# Altium schematic sheet Power Input and Regulators.SchDoc
size A; DocumentNumber: 11; SheetNumber: 11; SheetTotal: 11
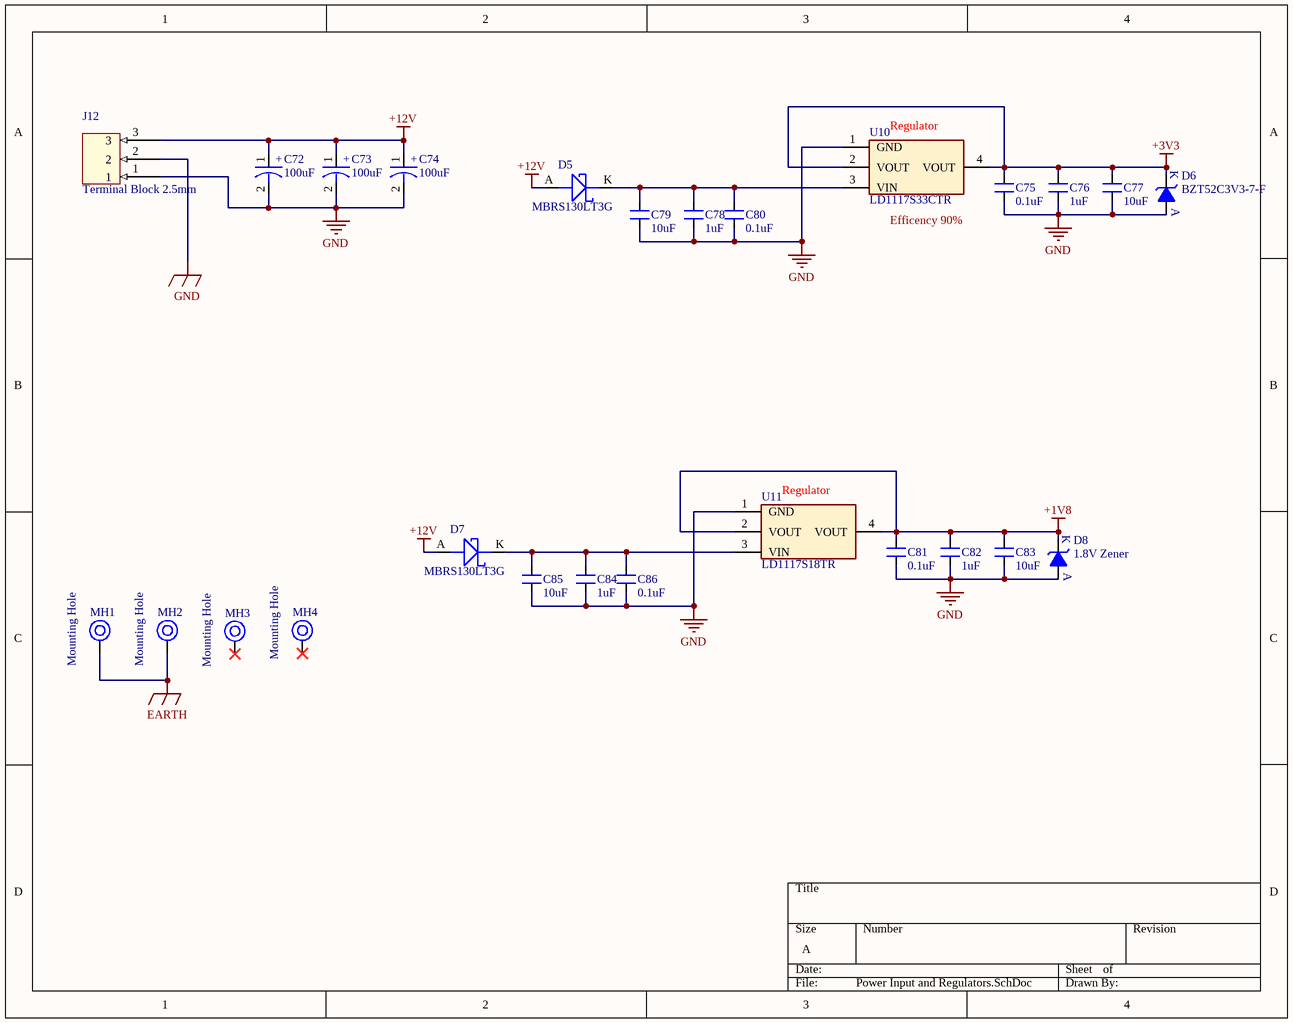
[diagram p0: Power Input and Regulators.SchDoc]

## Parts
C72  100uF  [ACAP_P305_D393_H393_RAD]
C73  100uF  [ACAP_P305_D393_H393_RAD]
C74  100uF  [ACAP_P305_D393_H393_RAD]
C75  0.1uF  [CAP_0805]
C76  1uF  [CAP_0805]
C77  10uF  [CAP_1206]
C78  1uF  [CAP_0805]
C79  10uF  [CAP_1206]
C80  0.1uF  [CAP_0805]
C81  0.1uF  [CAP_0805]
C82  1uF  [CAP_0805]
C83  10uF  [CAP_1206]
C84  1uF  [CAP_0805]
C85  10uF  [CAP_1206]
C86  0.1uF  [CAP_0805]
D5  MBRS130LT3G  [DIO_SMB_DO-214AA]
D6  BZT52C3V3-7-F  [DIO_SOD-123]
D7  MBRS130LT3G  [DIO_SMB_DO-214AA]
D8  1.8V Zener  [DIO_DO-213AB_SMD]
J12  Terminal Block 2.5mm  [CON3_100_TB_TH_ST]
MH1  Mounting Hole  [MOUNTING]
MH2  Mounting Hole  [MOUNTING]
MH3  Mounting Hole  [MOUNTING]
MH4  Mounting Hole  [MOUNTING]
U10  LD1117S33CTR  [SOT223_3]
U11  LD1117S18TR  [SOT223_3]

## Nets
+1V8: C81.2 C82.2 C83.2 D8.K U11.2(VOUT) U11.4(VOUT)
+3V3: C75.2 C76.2 C77.2 D6.K U10.2(VOUT) U10.4(VOUT)
+12V: C72.1 C73.1 C74.1 D5.A D7.A J12.3
EARTH: MH1.1 MH2.1
GND: C72.2 C73.2 C74.2 C75.1 C76.1 C77.1 C78.2 C79.1 C80.1 C81.1 C82.1 C83.1 C84.2 C85.1 C86.1 D6.A D8.A J12.1 J12.2 U10.1(GND) U11.1(GND)
NetC78_1: C78.1 C79.2 C80.2 D5.K U10.3(VIN)
NetC84_1: C84.1 C85.2 C86.2 D7.K U11.3(VIN)

Not connected (* = marked no-connect by the designer): MH3 1*; MH4 1*

## Notes on the sheet
- (near U10) Regulator
- Efficency 90%
- (near U11) Regulator
- (in symbol CAP-P_100uF-50V-20%-RAD) +

## Library data of the parts
C72-C74 = CAP-P_100uF-50V-20%-RAD: 100µF 50V Aluminum Polymer Capacitor Radial, Can - SMD 28mOhm 4000 Hrs @ 125°C; Manufacturer: Nichicon; Manufacturer Part Number: GYA1H101MCQ1GS; Alternate Part Number-1: VEU101M1HTR-1010; Case/Package: Radial-SMD; Supplier-1: SP ROAD; Supplier Part Number-1: GYA1H101MCQ1GS
C75 C80 C81 C86 = CAP_0.1uF-50V-10%-0805: 0.1µF ±10% 50V Ceramic Capacitor X7R 0805 (2012 Metric); Manufacturer: Samsung; Manufacturer Part Number: CL21B104KBCNNNC; Alternate Part Number-1: NA; Case/Package: 0805; Supplier-1: SIRICOM; Supplier Part Number-1: 0805B104K500CT
C76 C78 C82 C84 = CAP_1uF-50V-5%-0805: 1µF ±5% 50V Ceramic Capacitor X7R 0805 (2012 Metric); Manufacturer: Samsung; Manufacturer Part Number: CC0805JKX7R9BB105; Alternate Part Number-1: 0805F105M500NT; Case/Package: 0805; Supplier-1: SIRICOM; Supplier Part Number-1: CL21B105KBFNNNE
C77 C79 C83 C85 = CAP_10uF-50V-10%-1206: 10µF ±10% 50V Ceramic Capacitor X7R 1206 (3216 Metric); Manufacturer: KEMET; Manufacturer Part Number: CL31B106KBHNNNE; Alternate Part Number-1: GRT31CR61H106ME01L; Case/Package: 1206; Supplier-1: SIRICOM; Supplier Part Number-1: CC1206KKX5R9BB106
D5 D7 = DIO-S_445mV-30V-2A-SMB: Diode Schottky 30V 2A Surface Mount SMB; Manufacturer: ON Semiconductor; Alternate Part Number-1: NA; Manufacturer Part Number: MBRS130LT3G; Case/Package: SMB; Supplier-1: ARROW; Supplier Part Number-1: MBRS130LT3G
D6 = DIO-Z_3.3V-500mW-SOD123: Zener Diode 3.3V 500mW ±6% Surface Mount SOD-123; Manufacturer: Diodes Incorporated; Alternate Part Number-1: NA; Manufacturer Part Number: BZT52C3V3-7-F; Case/Package: SOD-123; Supplier-1: Digikey; Supplier Part Number-1: BZT52C3V3-FDICT-ND
D8 = DIO-Z_1.8V-500mW-DO213AA: Zener Diode 1.8V 500mW ±5% Surface Mount DO-213AA; Manufacturer: *; Manufacturer Part Number: *; Case/Package: *; Supplier-1: *; Supplier Part Number-1: *; Alternate Part Number-1: *
J12 = CON-TB_3X1-100-ST-TH: 3 Pins, 1 Row 2.54mm Pitch, straight Connector, male; Manufacturer Part Number: 1725669; Manufacturer: Phoenix Contact; Alternate Part Number-1: NA; Case/Package: TH-CON; Supplier-1: SP ROAD; Supplier Part Number-1: 1725669
MH1-MH4 = MH_3.5H_6D: Manufacturer Part Number: NA; Case/Package: TH; Manufacturer: NA; Supplier-1: NA; Supplier Part Number-1: NA; Alternate Part Number-1: NA
U10 = REG_15V-3.3V-0.9A-12W-SOT223: Linear Voltage Regulator IC 1 Output 800mA SOT-223; Manufacturer: STMicroelectronics; Alternate Part Number-1: NA; Manufacturer Part Number: LD1117S33CTR; Case/Package: SOT223; Supplier-1: SP ROAD; Supplier Part Number-1: LD1117S33CTR
U11 = REG_15V-1.8V-0.8A-1.4W-SOT223: LDO Voltage Regulators 1.8V 0.8A Positive; Manufacturer: STMicroelectronics; Alternate Part Number-1: NA; Manufacturer Part Number: LD1117S18TR; Case/Package: SOT-223-3; Supplier-1: Mouser; Supplier Part Number-1: 511-LD1117S18-TR